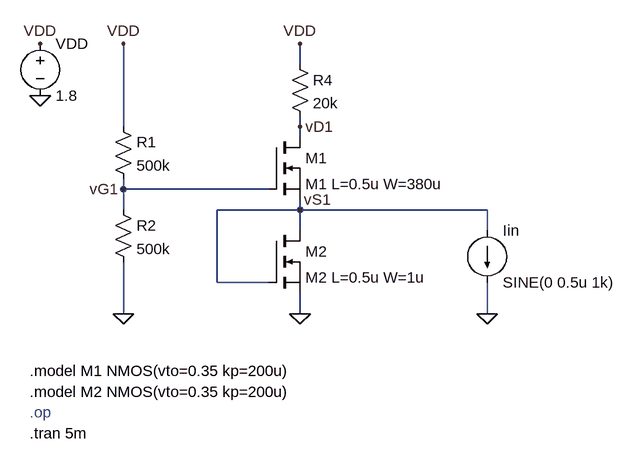
[diagram p0: schematic hw4_112021117_2d.asc]
hw4_112021117_2d.asc, the LTspice schematic file:
Version 4.1
SHEET 1 880 720
WIRE 336 48 336 16
WIRE 64 144 64 16
WIRE 336 144 336 128
WIRE 336 160 336 144
WIRE 64 240 64 224
WIRE 288 240 64 240
WIRE 64 272 64 240
WIRE 336 272 336 256
WIRE 336 272 208 272
WIRE 624 272 336 272
WIRE 336 304 336 272
WIRE 624 304 624 272
WIRE 208 384 208 272
WIRE 288 384 208 384
WIRE 64 432 64 352
WIRE 336 432 336 400
WIRE 624 432 624 384
FLAG 64 432 0
FLAG -64 96 0
FLAG 64 16 VDD
FLAG 336 16 VDD
FLAG -64 16 VDD
FLAG 624 432 0
FLAG 64 240 vG1
FLAG 336 272 vS1
FLAG 336 144 vD1
FLAG 336 432 0
SYMBOL res 48 128 R0
SYMATTR InstName R1
SYMATTR Value 500k
SYMBOL res 48 256 R0
SYMATTR InstName R2
SYMATTR Value 500k
SYMBOL nmos 288 160 R0
SYMATTR InstName M1
SYMATTR Value M1 L=0.5u W=380u
SYMBOL res 320 32 R0
SYMATTR InstName R4
SYMATTR Value 20k
SYMBOL voltage -64 0 R0
SYMATTR InstName VDD
SYMATTR Value 1.8
SYMBOL current 624 304 R0
WINDOW 123 0 0 Left 0
WINDOW 39 0 0 Left 0
SYMATTR InstName Iin
SYMATTR Value SINE(0 0.5u 1k)
SYMBOL nmos 288 304 R0
SYMATTR InstName M2
SYMATTR Value M2 L=0.5u W=1u
TEXT -80 520 Left 2 !.model M1 NMOS(vto=0.35 kp=200u)
TEXT -80 584 Left 2 ;.op
TEXT -80 616 Left 2 !.tran 5m
TEXT -80 552 Left 2 !.model M2 NMOS(vto=0.35 kp=200u)

The netlist it stands for:
* hw4_112021117_2d.asc
R1 VDD vG1 500k
R2 vG1 0 500k
M1 vD1 vG1 vS1 vS1 M1 L=0.5u W=380u
R4 VDD vD1 20k
VDD VDD 0 1.8
Iin vS1 0 SINE(0 0.5u 1k)
M2 vS1 vS1 0 0 M2 L=0.5u W=1u
.model NMOS NMOS
.model PMOS PMOS
.lib standard.mos
.model M1 NMOS(vto=0.35 kp=200u)
* .op
.tran 5m
.model M2 NMOS(vto=0.35 kp=200u)
.backanno
.end